# EAGLE design Cart64out (EAGLE 9.5.2)
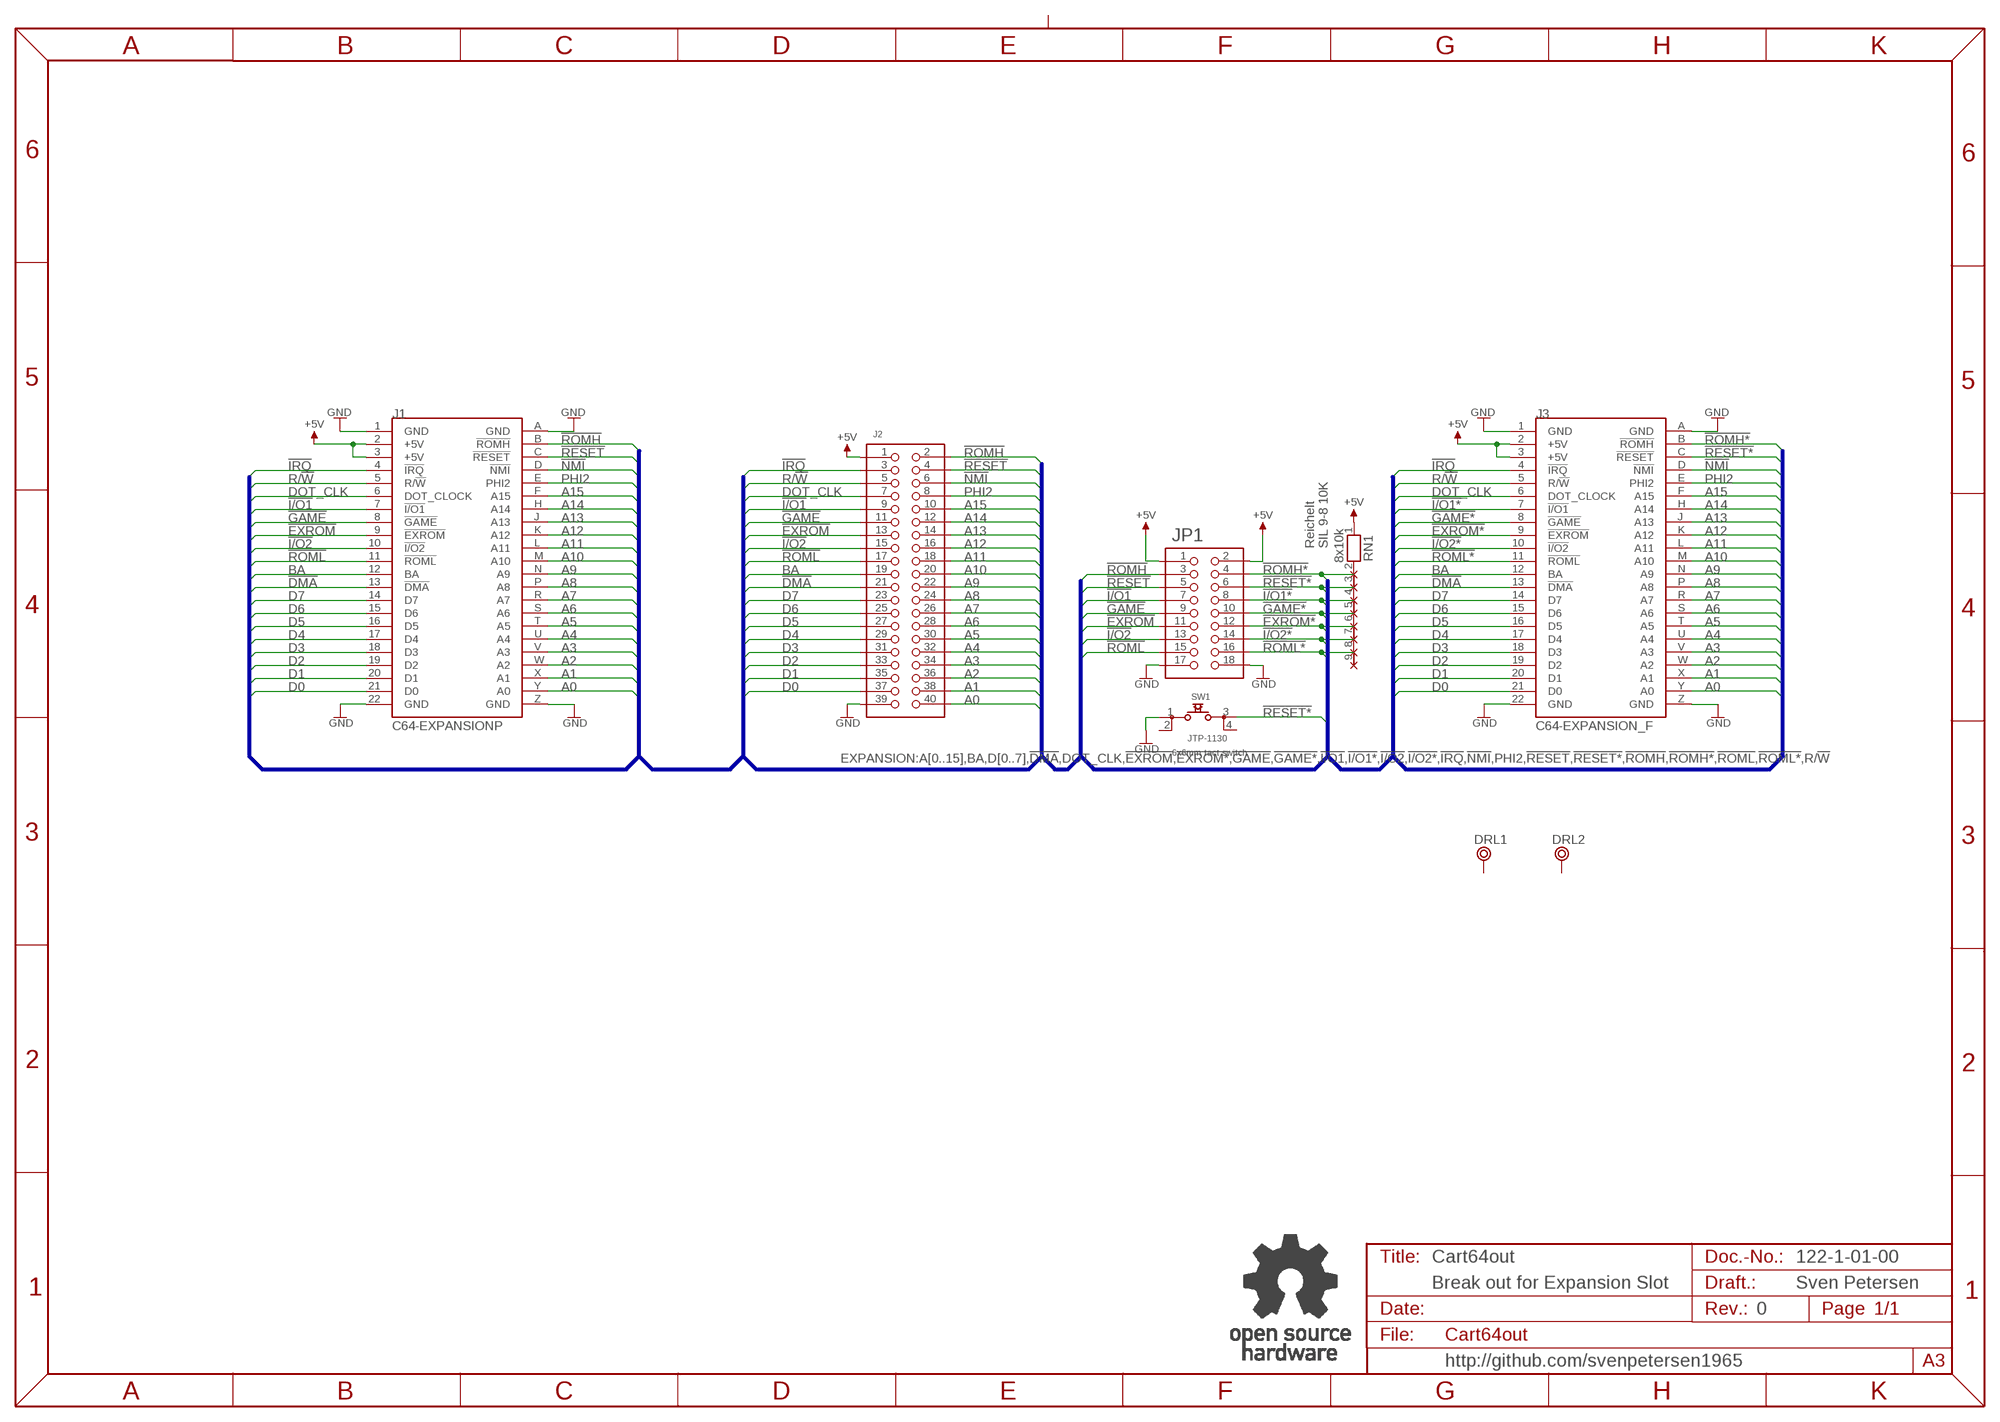
[diagram p0: schematic, sheet 1]

## Parts
DRL1  BOHR3,3  [BOHR3,3]
DRL2  BOHR3,3  [BOHR3,3]
J1  C64-EXPANSIONP  [EXPPORT]
J2  PINHD-2X20WV  [2X20WV]
J3  C64-EXPANSION_F  [EXPANSION_OUT]
JP1  PINHD-2X9  [2X09]
RN1  8x10k  RN08  [RN-9]
SW1  JTP-1130  [JTP-1130]
U$22  OPEN_SOURCE_HW  [OPENHW]

## Nets
!DMA: J1.13(!DMA) J2.21 J3.13(!DMA)
!EXROM: J1.9(!EXROM) J2.13 JP1.11
!EXROM*: J3.9(!EXROM) JP1.12 RN1.6
!GAME: J1.8(!GAME) J2.11 JP1.9
!GAME*: J3.8(!GAME) JP1.10 RN1.5
!I/O1: J1.7(!I/O1) J2.9 JP1.7
!I/O1*: J3.7(!I/O1) JP1.8 RN1.4
!I/O2: J1.10(!I/O2) J2.15 JP1.13
!I/O2*: J3.10(!I/O2) JP1.14 RN1.7
!IRQ: J1.4(!IRQ) J2.3 J3.4(!IRQ)
!NMI: J1.D(!NMI) J2.6 J3.D(!NMI)
!RESET: J1.C(!RESET) J2.4 JP1.5
!RESET*: J3.C(!RESET) JP1.6 RN1.3 SW1.3
!ROMH: J1.B(!ROMH) J2.2 JP1.3
!ROMH*: J3.B(!ROMH) JP1.4 RN1.2
!ROML: J1.11(!ROML) J2.17 JP1.15
!ROML*: J3.11(!ROML) JP1.16 RN1.8
+5V: J1.2(+5V) J1.3(+5V) J2.1 J3.2(+5V) J3.3(+5V) JP1.1 JP1.2 RN1.1
A0: J1.Y(A0) J2.40 J3.Y(A0)
A1: J1.X(A1) J2.38 J3.X(A1)
A2: J1.W(A2) J2.36 J3.W(A2)
A3: J1.V(A3) J2.34 J3.V(A3)
A4: J1.U(A4) J2.32 J3.U(A4)
A5: J1.T(A5) J2.30 J3.T(A5)
A6: J1.S(A6) J2.28 J3.S(A6)
A7: J1.R(A7) J2.26 J3.R(A7)
A8: J1.P(A8) J2.24 J3.P(A8)
A9: J1.N(A9) J2.22 J3.N(A9)
A10: J1.M(A10) J2.20 J3.M(A10)
A11: J1.L(A11) J2.18 J3.L(A11)
A12: J1.K(A12) J2.16 J3.K(A12)
A13: J1.J(A13) J2.14 J3.J(A13)
A14: J1.H(A14) J2.12 J3.H(A14)
A15: J1.F(A15) J2.10 J3.F(A15)
BA: J1.12(BA) J2.19 J3.12(BA)
D0: J1.21(D0) J2.37 J3.21(D0)
D1: J1.20(D1) J2.35 J3.20(D1)
D2: J1.19(D2) J2.33 J3.19(D2)
D3: J1.18(D3) J2.31 J3.18(D3)
D4: J1.17(D4) J2.29 J3.17(D4)
D5: J1.16(D5) J2.27 J3.16(D5)
D6: J1.15(D6) J2.25 J3.15(D6)
D7: J1.14(D7) J2.23 J3.14(D7)
DOT_CLK: J1.6(DOT_CLOCK) J2.7 J3.6(DOT_CLOCK)
GND: J1.1(GND) J1.22(GND) J1.A(GND) J1.Z(GND) J2.39 J3.1(GND) J3.22(GND) J3.A(GND) J3.Z(GND) JP1.17 JP1.18 SW1.1
PHI2: J1.E(PHI2) J2.8 J3.E(PHI2)
R/!W: J1.5(R/!W) J2.5 J3.5(R/!W)
Unconnected: DRL1.P$1 DRL2.P$1 RN1.9 SW1.2 SW1.4

## Buses
EXPANSION:A[0..15],BA,D[0..7],!DMA,DOT_CLK,!EXROM,!EXROM*,!GAME,!GAME*,!I/O1,!I/O1*,!I/O2,!I/O2*,!IRQ,!NMI,PHI2,!RESET,!RESET*,!ROMH,!ROMH*,!ROML,!ROML*,R/!W

## Notes on the sheet
- Reichelt
  SIL 9-8 10K
- 6x6mm tact switch
- Cart64out | 122-1-01-00
- Break out for Expansion Slot | Sven Petersen
- 0
- http://github.com/svenpetersen1965

## Library data of the parts
DRL1 DRL2 = Mech_Bohr:BOHR3,3
J1 = Commodore:C64-EXPANSIONP
J2 = PINHEAD:PINHD-2X20
J3 = Commodore:C64-EXPANSION_F
JP1 = PINHEAD:PINHD-2X9
RN1 = DISCRETE:RN08
SW1 = Namae_Electronics:JTP-1130
U$22 = Logo:OPEN_SOURCE_HW

## Board
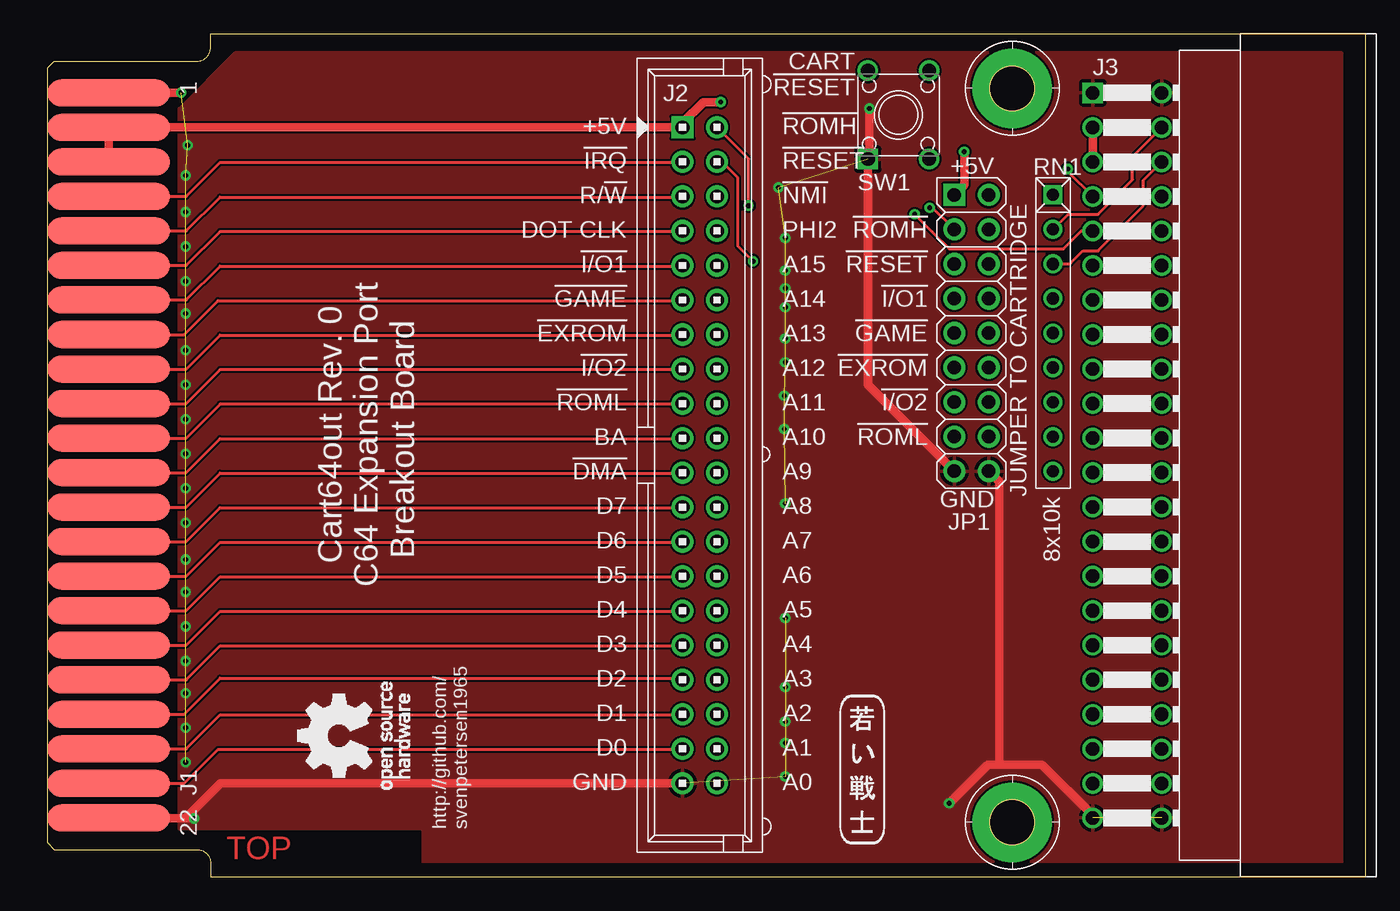
[diagram p1: board, top side]
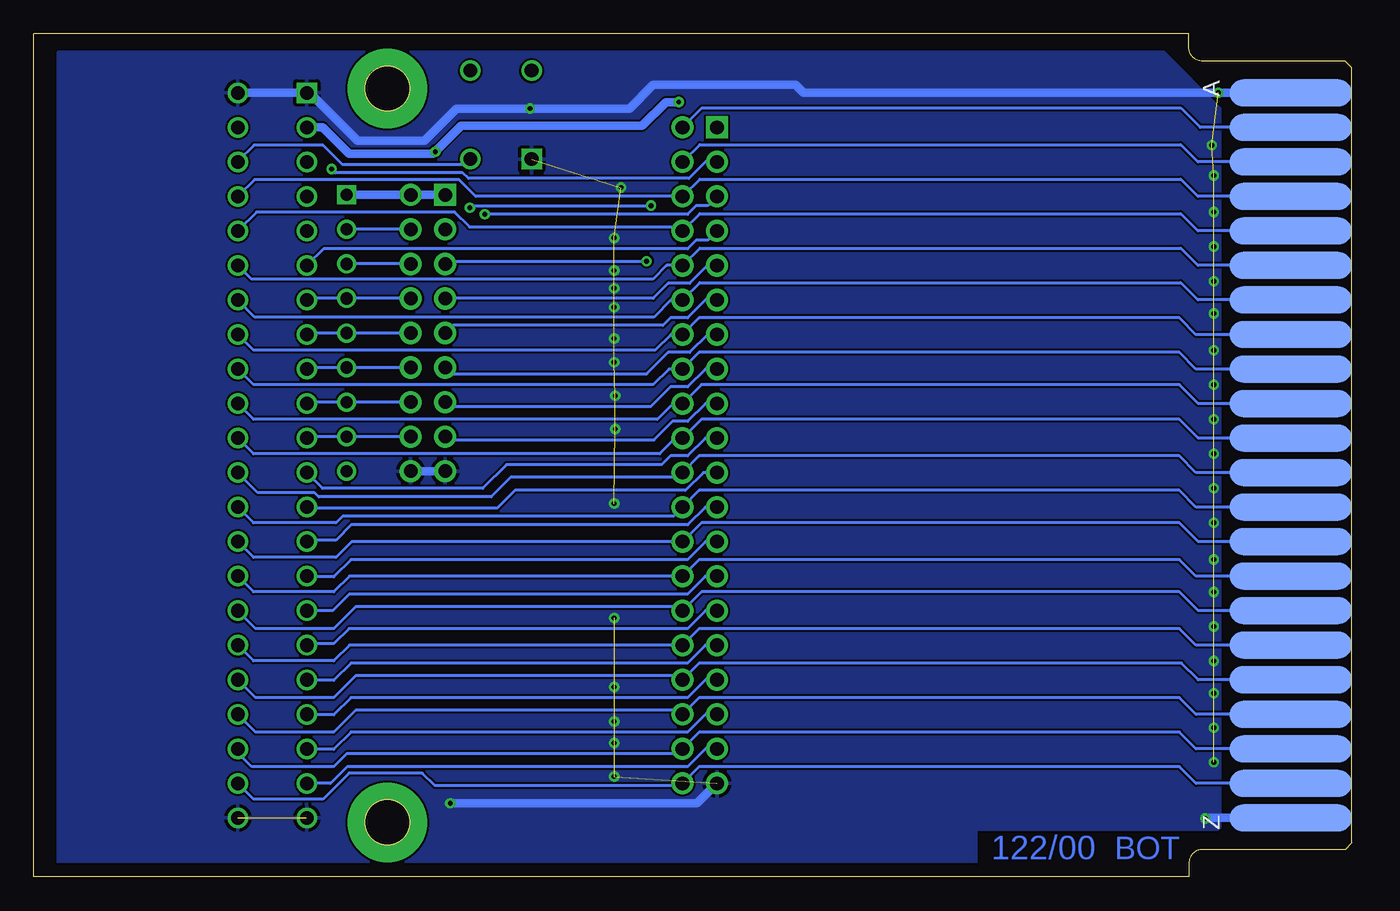
[diagram p2: board, bottom side, seen from below]

Size 97 x 62 mm. Coordinates in mm from the lower left corner, seen from the top.
Outline: 11,2 arc-90 12,1 12,0 83,0 97,0 97,62 12,62 12,61 arc-90 11,60
Copper layers (1*16): Top 0.035mm / dielectric 1.5mm / Bottom 0.035mm
Design rules "default *": minimum track width 6mil, minimum drill 0.35mm, track to track 6mil, track to pad 6mil, pad to pad 6mil, via to via 6mil, smd to smd 6mil, copper to edge 40mil, drill to drill 6mil, minimum pad ring 10mil, minimum via ring 8mil, stop-mask expansion 4mil, vias tented up to drill 25mil, thermal gap 10mil

### Footprints (pad centres in the part's own frame; a part is rotated, then mirrored left to right if it is on the bottom)
BOHR3,3 = drill 3.302 pad 5.842: P$1 0,0
EXPPORT = smd 2 x 9: 1 26.67,-4.5; 2 24.13,-4.5; 3 21.59,-4.5; 4 19.05,-4.5; 5 16.51,-4.5; 6 13.97,-4.5; 7 11.43,-4.5; 8 8.89,-4.5; 9 6.35,-4.5; 10 3.81,-4.5; 11 1.27,-4.5; 12 -1.27,-4.5; 13 -3.81,-4.5; 14 -6.35,-4.5; 15 -8.89,-4.5; 16 -11.43,-4.5; 17 -13.97,-4.5; 18 -16.51,-4.5; 19 -19.05,-4.5; 20 -21.59,-4.5; 21 -24.13,-4.5; 22 -26.67,-4.5 | smd 2 x 9 bottom: A 26.67,-4.5; B 24.13,-4.5; C 21.59,-4.5; D 19.05,-4.5; E 16.51,-4.5; F 13.97,-4.5; H 11.43,-4.5; J 8.89,-4.5; K 6.35,-4.5; L 3.81,-4.5; M 1.27,-4.5; N -1.27,-4.5; P -3.81,-4.5; R -6.35,-4.5; S -8.89,-4.5; T -11.43,-4.5; U -13.97,-4.5; V -16.51,-4.5; W -19.05,-4.5; X -21.59,-4.5; Y -24.13,-4.5; Z -26.67,-4.5
2X20WV = drill 1 pad 1.626 square: 1 -24.13,-1.27 | drill 1 pad 1.626: 2 -24.13,1.27; 3 -21.59,-1.27; 4 -21.59,1.27; 5 -19.05,-1.27; 6 -19.05,1.27; 7 -16.51,-1.27; 8 -16.51,1.27; 9 -13.97,-1.27; 10 -13.97,1.27; 11 -11.43,-1.27; 12 -11.43,1.27; 13 -8.89,-1.27; 14 -8.89,1.27; 15 -6.35,-1.27; 16 -6.35,1.27; 17 -3.81,-1.27; 18 -3.81,1.27; 19 -1.27,-1.27; 20 -1.27,1.27; 21 1.27,-1.27; 22 1.27,1.27; 23 3.81,-1.27; 24 3.81,1.27; 25 6.35,-1.27; 26 6.35,1.27; 27 8.89,-1.27; 28 8.89,1.27; 29 11.43,-1.27; 30 11.43,1.27; 31 13.97,-1.27; 32 13.97,1.27; 33 16.51,-1.27; 34 16.51,1.27; 35 19.05,-1.27; 36 19.05,1.27; 37 21.59,-1.27; 38 21.59,1.27; 39 24.13,-1.27; 40 24.13,1.27
EXPANSION_OUT = drill 1 square: 1 -5.08,26.67 | drill 1: 2 -5.08,24.13; 3 -5.08,21.59; 4 -5.08,19.05; 5 -5.08,16.51; 6 -5.08,13.97; 7 -5.08,11.43; 8 -5.08,8.89; 9 -5.08,6.35; 10 -5.08,3.81; 11 -5.08,1.27; 12 -5.08,-1.27; 13 -5.08,-3.81; 14 -5.08,-6.35; 15 -5.08,-8.89; 16 -5.08,-11.43; 17 -5.08,-13.97; 18 -5.08,-16.51; 19 -5.08,-19.05; 20 -5.08,-21.59; 21 -5.08,-24.13; 22 -5.08,-26.67; A 0,26.67; B 0,24.13; C 0,21.59; D 0,19.05; E 0,16.51; F 0,13.97; H 0,11.43; J 0,8.89; K 0,6.35; L 0,3.81; M 0,1.27; N 0,-1.27; P 0,-3.81; R 0,-6.35; S 0,-8.89; T 0,-11.43; U 0,-13.97; V 0,-16.51; W 0,-19.05; X 0,-21.59; Y 0,-24.13; Z 0,-26.67
2X09 = drill 1 pad 1.626 square: 1 -10.16,-1.27 | drill 1 pad 1.626: 2 -10.16,1.27; 3 -7.62,-1.27; 4 -7.62,1.27; 5 -5.08,-1.27; 6 -5.08,1.27; 7 -2.54,-1.27; 8 -2.54,1.27; 9 0,-1.27; 10 0,1.27; 11 2.54,-1.27; 12 2.54,1.27; 13 5.08,-1.27; 14 5.08,1.27; 15 7.62,-1.27; 16 7.62,1.27; 17 10.16,-1.27; 18 10.16,1.27
RN-9 = drill 0.889 pad 1.397 square: 1 -10.16,0 | drill 0.889 pad 1.397: 2 -7.62,0; 3 -5.08,0; 4 -2.54,0; 5 0,0; 6 2.54,0; 7 5.08,0; 8 7.62,0; 9 10.16,0
JTP-1130 = drill 1 square: 1 3.25,-2.25 | drill 1: 2 -3.25,-2.25; 3 3.25,2.25; 4 -3.25,2.25

### Placement (x,y rotation side)
DRL1  71,58 0 top
DRL2  71,4 0 top
J1  0,31 90 top
J2  48,31 270 top
J3  82,31 0 top
JP1  68,40 270 top
RN1  74,40 270 top
SW1  62.63,56.05 270 top
U$20  [2LAYER]  13.18,1.27 0 top
U$21  [PCB-TITLE/]  0,73.66 0 top  (outside the outline)
U$22  26.67,6.43 90 top
U$23  [SVEN_TAG]  60,8 0 top

### Tracks (layer width: path | path; a pad name or v marks a point on that pad's centre or on a via)
!DMA
  Top 0.203: J1.13 10.2,27.19 12.7,29.69 46.69,29.69 J2.21
  Bottom 0.203: J2.21 47.74,29.73 49.05,28.42 61.59,28.42 62.87,27.15 76.88,27.15 J3.13
!EXROM
  Top 0.203: J1.9 10.2,37.35 12.7,39.85 46.69,39.85 J2.13
  Bottom 0.203: J2.13 47.42,39.89 48.74,38.58 50.32,38.58 51.91,36.99 66.26,36.99 JP1.11
!EXROM*
  Bottom 0.203: JP1.12 RN1.6 76.81,37.46 J3.9
!GAME
  Top 0.203: J1.8 10.04,39.89 12.54,42.39 46.69,42.39 J2.11
  Bottom 0.203: J2.11 47.58,42.43 48.9,41.12 50.16,41.12 50.72,40.56 66.17,40.56 JP1.9
!GAME*
  Bottom 0.203: JP1.10 RN1.5 76.81,40 J3.8
!I/O1
  Top 0.203: J1.7 10.2,42.43 12.7,44.93 46.69,44.93 J2.9
  Bottom 0.203: J2.9 47.42,44.97 48.74,43.66 50.32,43.66 51.44,42.55 JP1.7
!I/O1*
  Bottom 0.203: JP1.8 RN1.4 76.81,42.54 J3.7
!I/O2
  Top 0.203: J1.10 10.2,34.81 12.7,37.31 46.69,37.31 J2.15
  Bottom 0.203: J2.15 47.58,37.35 48.9,36.04 50.16,36.04 51.6,34.6 66.41,34.6 JP1.13
!I/O2*
  Bottom 0.203: JP1.14 RN1.7 76.81,34.92 J3.10
!IRQ  (via drill 0.35)
  Top 0.203: J1.4 10.2,50.05 12.7,52.55 46.69,52.55 J2.3 | v75.09,52.07 75.09,51.88 J3.4
  Bottom 0.203: J2.3 47.58,52.59 48.8,51.38 65.03,51.38 65.44,51.79 74.81,51.79 v75.09,52.07
!NMI
  Bottom 0.203: J1.D 11.33,50.05 12.6,51.32 48,51.32 J2.6 64.5,50.05 65.25,50.8 65.72,51.28 80.77,51.28 J3.D
!RESET  (via drill 0.35)
  Top 0.203: v51.91,45.28 50.8,46.4 50.8,51.44 49.65,52.59 J2.4
  Bottom 0.203: J1.C 11.33,52.59 12.6,53.86 48,53.86 J2.4 | JP1.5 66.53,45.28 v51.92,45.28 v51.91,45.28
!RESET*
  Top 0.203: RN1.3 75.24,45.08 76.2,46.04 77.31,46.04 80.64,49.37 80.64,51.23 J3.C
  Bottom 0.203: JP1.6 RN1.3 | SW1.3 65.29,52.39 74.3,52.39 75.72,53.82 80.8,53.82 82,52.62 J3.C
!ROMH  (via drill 0.35)
  Top 0.203: JP1.3 65.14,49.21 v64.93,49.21 | v51.59,49.37 51.59,52.81 J2.2
  Bottom 0.203: J1.B 11.17,55.13 12.6,56.56 47.84,56.56 J2.2 | v51.59,49.37 v51.6,49.37 64.71,49.37 64.87,49.21 v64.93,49.21
!ROMH*
  Top 0.203: RN1.2 75.12,48.74 77.31,48.74 79.85,51.28 79.85,52.98 J3.B
  Bottom 0.203: JP1.4 RN1.2
!ROML
  Top 0.203: J1.11 10.2,32.27 12.7,34.77 46.69,34.77 J2.17
  Bottom 0.203: J2.17 47.58,34.81 48.9,33.5 50.01,33.5 51.36,32.14 66.49,32.14 JP1.15
!ROML*
  Bottom 0.203: JP1.16 RN1.8 76.81,32.38 J3.11
+5V  (via drill 0.35)
  Top 0.61: J1.3 J1.2 J2.1 46.73,55.46 48.26,56.99 v49.54,56.99 | v67.47,53.34 67.47,50.9 JP1.1 | J3.2 J3.3
  Bottom 0.61: v49.54,56.99 50.5,56.99 52.24,55.24 65.56,55.24 v67.47,53.34 67.63,53.18 73.82,53.18 75.77,55.13 J3.2 | JP1.1 JP1.2 RN1.1
A0
  Bottom 0.203: J1.Y 11.47,6.87 12.7,8.1 48.04,8.1 J2.40 49.43,6.71 67.51,6.71 68.42,7.62 73.82,7.62 75.72,5.71 80.84,5.71 J3.Y
A1
  Bottom 0.203: J1.X 11.47,9.41 12.7,10.64 48.04,10.64 J2.38 49.63,9.05 73.98,9.05 74.93,8.1 80.96,8.1 82,9.13 J3.X
A2
  Bottom 0.203: J1.W 11.47,11.95 12.7,13.18 48.04,13.18 J2.36 49.59,12.27 73.3,12.27 74.93,10.64 80.69,10.64 J3.W
A3
  Bottom 0.203: J1.V 11.31,14.49 12.54,15.72 48.04,15.72 J2.34 49.59,14.81 73.3,14.81 74.93,13.18 80.69,13.18 J3.V
A4
  Bottom 0.203: J1.U 11.47,17.03 12.7,18.26 48.04,18.26 J2.32 73.78,17.03 74.93,15.88 80.84,15.88 J3.U
A5
  Bottom 0.203: J1.T 11.31,19.57 12.7,20.95 47.88,20.95 J2.30 49.59,19.89 73.3,19.89 74.93,18.26 80.69,18.26 J3.T
A6
  Bottom 0.203: J1.S 11.47,22.11 12.7,23.34 48.04,23.34 J2.28 73.78,22.11 74.93,20.95 80.84,20.95 J3.S
A7
  Bottom 0.203: J1.R 11.31,24.65 12.7,26.04 47.88,26.04 J2.26 73.62,24.65 74.77,23.5 80.84,23.5 J3.R
A8
  Bottom 0.203: J1.P 11.47,27.19 12.7,28.42 48.04,28.42 J2.24 49.91,26.55 74.25,26.55 74.77,26.04 80.84,26.04 J3.P
A9
  Bottom 0.203: J1.N 11.47,29.73 12.7,30.96 48.04,30.96 J2.22 49.59,29.41 61.87,29.41 63.34,27.94 76.04,27.94 76.36,28.26 80.53,28.26 J3.N
A10
  Bottom 0.203: J1.M 11.31,32.27 12.7,33.66 47.88,33.66 J2.20 49.8,32.27 50.96,31.11 80.84,31.11 J3.M
A11
  Bottom 0.203: J1.L 11.31,34.81 12.7,36.2 47.88,36.2 J2.18 49.96,34.81 51.12,33.66 80.84,33.66 J3.L
A12
  Bottom 0.203: J1.K 11.47,37.35 12.7,38.58 48.04,38.58 J2.16 50.28,37.35 51.44,36.2 80.84,36.2 J3.K
A13
  Bottom 0.203: J1.J 11.47,39.89 12.7,41.12 48.04,41.12 J2.14 50.12,39.89 51.28,38.73 80.84,38.73 J3.J
A14
  Bottom 0.203: J1.H 11.33,42.43 12.6,43.7 48,43.7 J2.12 50.12,42.43 51.38,41.17 80.75,41.17 J3.H
A15
  Bottom 0.203: J1.F 11.33,44.97 12.6,46.24 48,46.24 J2.10 50.44,44.97 51.45,43.96 80.99,43.96 J3.F
BA
  Top 0.203: J1.12 10.2,29.73 12.7,32.23 46.69,32.23 J2.19
  Bottom 0.203: J2.19 47.58,32.27 48.9,30.96 50.16,30.96 50.8,30.32 62.23,30.32 63.98,28.57 75.77,28.57 J3.12
D0
  Top 0.203: J1.21 10.04,6.87 12.54,9.37 46.69,9.37 J2.37
  Bottom 0.203: J2.37 47.58,9.41 48.9,8.1 73.95,8.1 75.17,6.87 J3.21
D1
  Top 0.203: J1.20 10.2,9.41 12.7,11.91 46.69,11.91 J2.35
  Bottom 0.203: J2.35 47.58,11.95 48.9,10.64 73.66,10.64 74.93,9.37 76.88,9.37 J3.20
D2
  Top 0.203: J1.19 10.04,11.95 12.7,14.61 46.62,14.61 J2.33
  Bottom 0.203: J2.33 47.58,14.49 48.9,13.18 73.66,13.18 74.93,11.91 76.88,11.91 J3.19
D3
  Top 0.203: J1.18 10.2,14.49 12.7,16.99 46.69,16.99 J2.31
  Bottom 0.203: J2.31 47.58,17.03 48.9,15.72 73.66,15.72 74.93,14.45 76.88,14.45 J3.18
D4
  Top 0.203: J1.17 10.2,17.03 12.7,19.53 46.69,19.53 J2.29
  Bottom 0.203: J2.29 47.58,19.57 48.9,18.26 73.82,18.26 74.93,17.14 76.81,17.14 J3.17
D5
  Top 0.203: J1.16 10.2,19.57 12.7,22.07 46.69,22.07 J2.27
  Bottom 0.203: J2.27 47.58,22.11 48.9,20.8 73.79,20.8 75.02,19.57 J3.16
D6
  Top 0.203: J1.15 10.2,22.11 12.7,24.61 46.69,24.61 J2.25
  Bottom 0.203: J2.25 47.58,24.65 48.9,23.34 73.66,23.34 74.93,22.07 76.88,22.07 J3.15
D7
  Top 0.203: J1.14 10.2,24.65 12.7,27.15 46.69,27.15 J2.23
  Bottom 0.203: J2.23 47.58,27.19 48.9,25.88 73.66,25.88 74.77,24.77 76.81,24.77 J3.14
DOT_CLK
  Top 0.203: J1.6 10.2,44.97 12.7,47.47 46.69,47.47 J2.7
  Bottom 0.203: J2.7 47.41,46.83 48.26,46.83 48.9,46.2 75.69,46.2 J3.6
GND  (via drill 0.35)  (35 unrouted)
  Top 0.61: J1.A 9.73,57.67 9.84,57.78 v9.84,57.67 | J2.39 12.74,6.87 10.16,4.29 4.54,4.29 | 4.54,4.29 J1.Z | v60.48,56.52 60.48,52.91 SW1.1 60.38,36.19 JP1.17 | JP1.18 70.06,29.05 70.06,8.26 | 70.06,8.26 70.01,8.26 69.22,8.26 v66.36,5.4 | 70.06,8.26 73.18,8.26 76.92,4.52 J3.22 | v10.79,4.29 4.54,4.29
  Bottom 0.61: J1.A v9.84,57.67 40.37,57.67 40.96,58.26 51.44,58.26 53.18,56.52 v60.48,56.52 65.88,56.52 68.26,54.13 70.64,54.13 73.18,54.13 76.72,57.67 J3.1 J3.A | JP1.17 JP1.18 | J2.39 48.2,5.4 v66.36,5.4 | J1.Z 10.75,4.33 v10.79,4.29
  other vias: 10.16,8.41 10.16,10.95 10.16,13.49 10.16,15.88 10.16,18.41 10.16,20.95 10.16,23.34 10.16,26.04 10.16,28.57 10.16,31.11 10.16,33.66 10.16,36.2 10.16,38.73 10.16,41.43 10.16,43.81 10.16,46.35 10.16,48.9 10.16,51.59 10.32,53.82 54.3,43.3 54.3,44.6 54.3,47 53.8,50.7 54.3,41.9 54.3,39.6 54.3,37.85 54.22,35.39 54.22,32.93 54.3,27.45 54.3,19.04 54.3,13.96 54.3,11.42 54.3,9.83 54.3,7.37
  pour Bottom: 9.68,56.52 13.81,60.64 95.25,60.64 95.25,0.95 27.62,0.95 27.62,3.49 9.84,3.49 9.68,3.65
  pour Top: 13.81,60.64 95.25,60.64 95.25,0.95 27.62,0.95 27.62,3.49 9.68,3.49 9.68,3.65 9.68,56.52
PHI2
  Bottom 0.203: J1.E 11.33,47.51 12.6,48.78 48,48.78 J2.8 49.57,47.81 64.95,47.81 66.04,48.9 80.61,48.9 J3.E
R/!W  (via drill 0.35)
  Top 0.203: J1.5 10.2,47.51 12.7,50.01 46.69,50.01 J2.5 | v63.82,48.74 65.09,47.47 66.36,46.2 74.77,46.2 76.08,47.51 J3.5
  Bottom 0.203: J2.5 47.41,49.37 48.26,49.37 48.9,48.74 v63.82,48.74

### Text on the board
Bottom: 122/00
tPlace: CART / !RESET | +5V | !ROMH | !IRQ | !RESET | +5V | R/!W | !NMI | JUMPER TO CARTRIDGE | DOT CLK | PHI2 | !ROMH | !I/O1 | A15 | !RESET | !GAME | A14 | !I/O1 | !EXROM | A13 | !GAME | !I/O2 | A12 | !EXROM | !ROML | A11 | !I/O2 | Cart64out Rev. 0 / C64 Expansion Port / Breakout Board | BA | A10 | !ROML | !DMA | A9 | 8x10k | D7 | A8 | GND | D6 | A7 | D5 | A6 | D4 | A5 | D3 | A4 | D2 | A3 | D1 | A2 | D0 | A1 | GND | A0 | http://github.com/ / svenpetersen1965
Document: Sven Petersen | 122-2-01-00 | 2019 | 35µm | 2 | 0